# EAGLE design 7segement4digits1badidea-mk-3-smd (EAGLE 6.5.0)
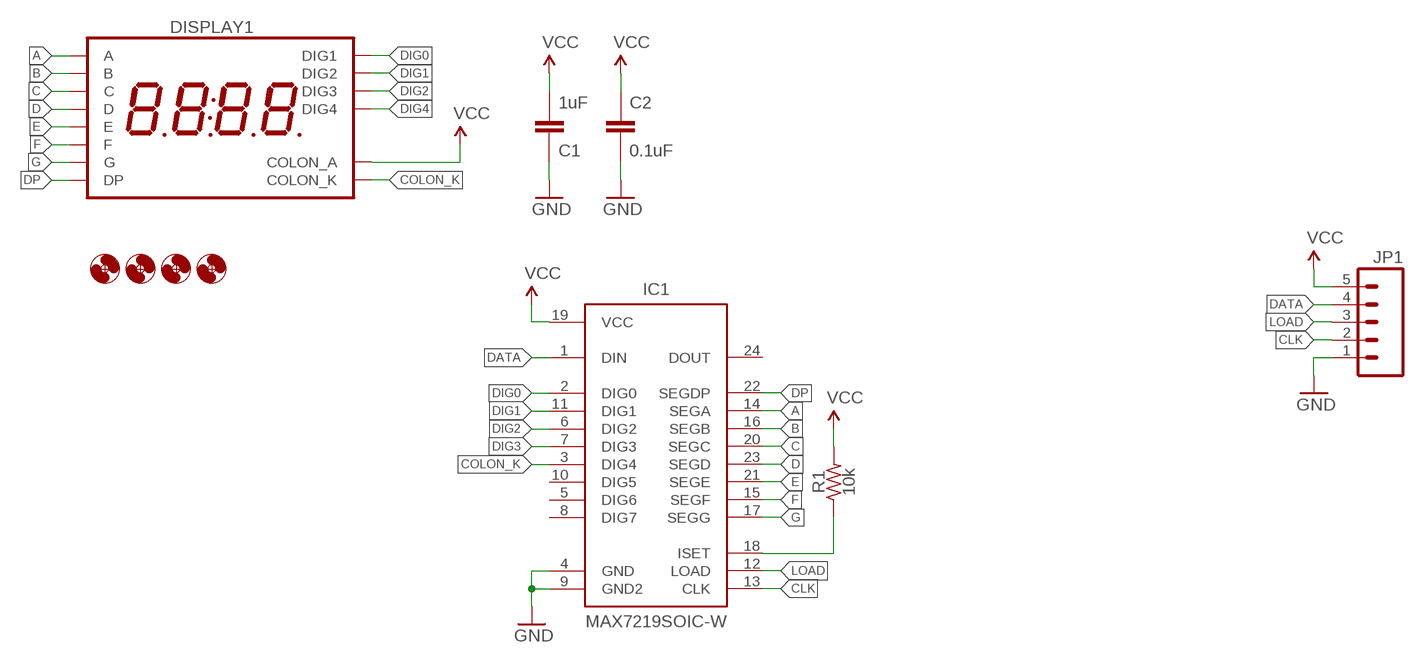
[diagram p0: schematic, sheet 1]

## Parts
C1  1uF  CAPACITOR-CERAMICC0805  [C0805]
C2  0.1uF  CAPACITOR-CERAMICC0603  [C0603]
DISPLAY1  7SEG_4DIGIT_COLONLOLSMDWAT  [7SEG_4DIG_0.56IN_14MM_ADAFRUIT_LOL_SMD_WAT]
H1  HOLE#2  [HOLE-#2]
H2  HOLE#2  [HOLE-#2]
H3  HOLE#2  [HOLE-#2]
H4  HOLE#2  [HOLE-#2]
IC1  MAX7219SOIC-W  [SO24W]
JP1  M05JST-PH-VERT-PTH  [JST-5-PH-VERT-PTH]
R1  10k  RESISTORR0603  [R0603]

## Nets
A: DISPLAY1.P$13(A) IC1.14(SEGA)
B: DISPLAY1.P$9(B) IC1.16(SEGB)
C: DISPLAY1.P$4(C) IC1.20(SEGC)
CLK: IC1.13(CLK) JP1.2
COLON_K: DISPLAY1.P$7(COLON_K) IC1.3(DIG4)
D: DISPLAY1.P$2(D) IC1.23(SEGD)
DATA: IC1.1(DIN) JP1.4
DIG0: DISPLAY1.P$14(DIG1) IC1.2(DIG0)
DIG1: DISPLAY1.P$11(DIG2) IC1.11(DIG1)
DIG2: DISPLAY1.P$10(DIG3) IC1.6(DIG2)
DIG3: IC1.7(DIG3)
DIG4: DISPLAY1.P$6(DIG4)
DP: DISPLAY1.P$3(DP) IC1.22(SEGDP)
E: DISPLAY1.P$1(E) IC1.21(SEGE)
F: DISPLAY1.P$12(F) IC1.15(SEGF)
G: DISPLAY1.P$5(G) IC1.17(SEGG)
GND: C1.1 C2.2 IC1.4(GND) IC1.9(GND2) JP1.1
LOAD: IC1.12(LOAD) JP1.3
N$1: IC1.18(ISET) R1.1
VCC: C1.2 C2.1 DISPLAY1.P$8(COLON_A) IC1.19(VCC) JP1.5 R1.2
Unconnected: IC1.5(DIG6) IC1.8(DIG7) IC1.10(DIG5) IC1.24(DOUT)

## Library data of the parts
C1 C2 = A_butts:CAPACITOR-CERAMIC: CAPACITOR, European symbol
DISPLAY1 = A_butts:7SEG_4DIGIT_COLON
H1-H4 = A_butts:HOLE: MOUNTING HOLE with drill center marker
IC1 = A_butts:MAX7219: 8-digit, 8-segment LED display driver, serial input
JP1 = A_butts:M05: Header 5 Standard 5-pin 0.1" header. Use with straight break away headers (SKU : PRT-00116), right angle break away headers (PRT-00553), swiss pins (PRT-00743), machine pins (PRT-00117), and female headers (PRT-00115). Molex polarized connector foot print use with SKU : PRT-08230 with associated crimp pins and housings.
R1 = A_butts:RESISTOR: RESISTOR, American symbol

## Board
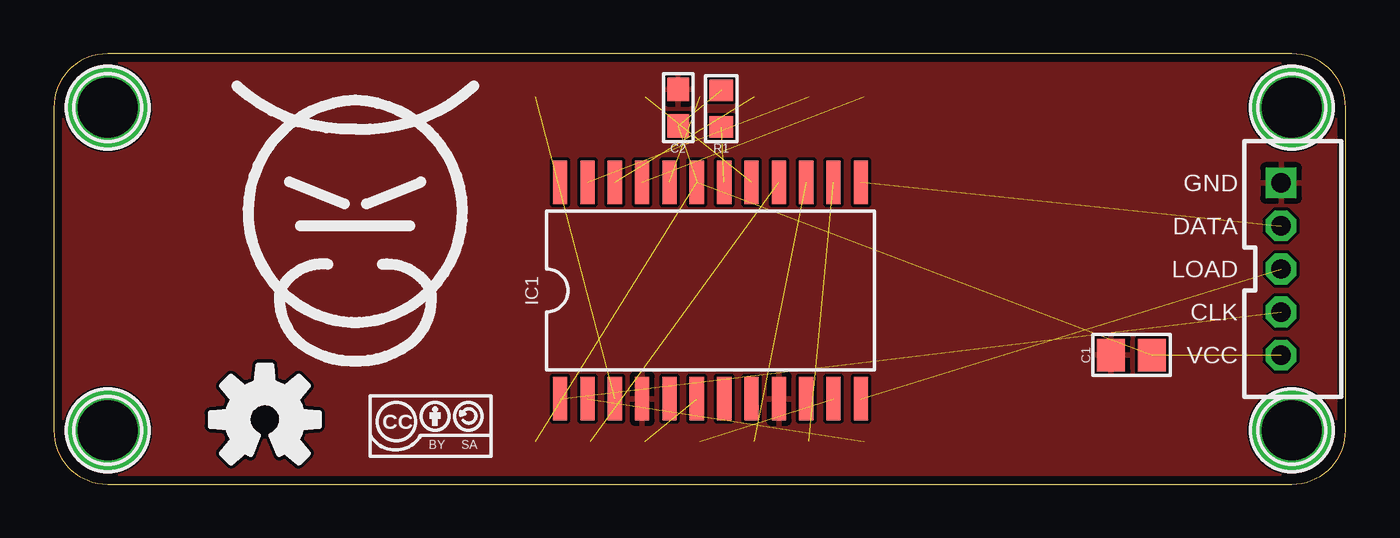
[diagram p1: board, top side]
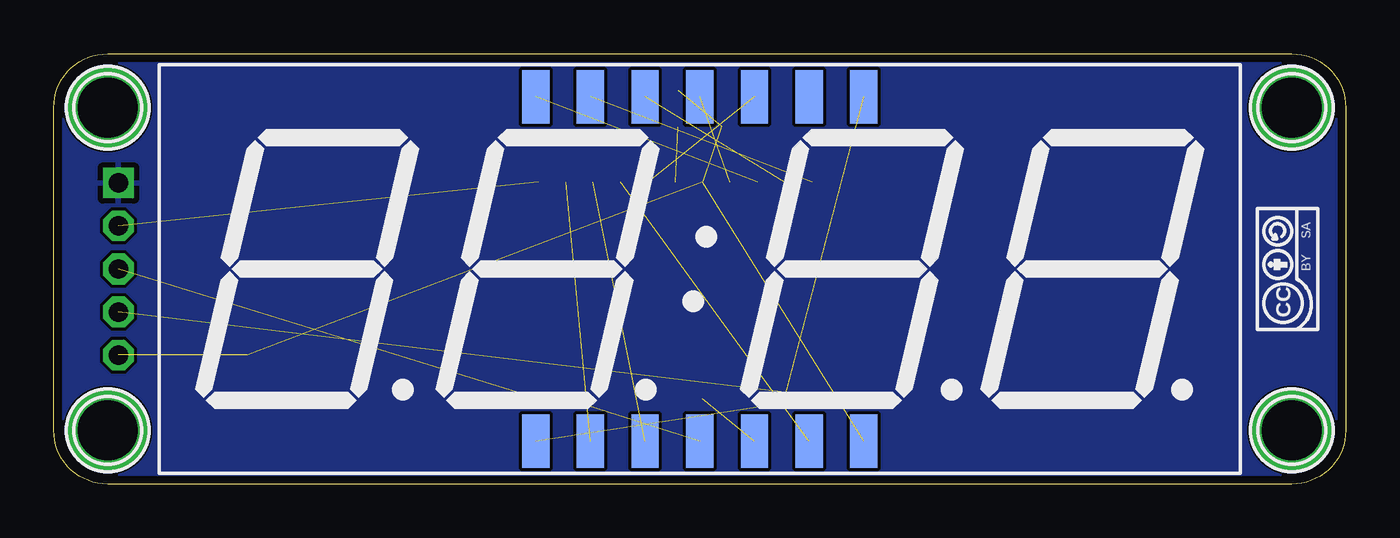
[diagram p2: board, bottom side, seen from below]

Size 60 x 20 mm. Coordinates in mm from the lower left corner, seen from the top.
Outline: 0,17.5 0,2.5 arc90 2.5,0 57.5,0 arc90 60,2.5 60,17.5 arc90 57.5,20 2.5,20 arc90 0,17.5
Copper layers (1*16): Top 0.0356mm / dielectric 1.5011mm / Bottom 0.0356mm
Design rules "LaenPCBOrder2": minimum track width 6mil, minimum drill 13mil, track to track 6mil, track to pad 6mil, pad to pad 6mil, via to via 6mil, smd to smd 6mil, copper to edge 15mil, drill to drill 6mil, minimum pad ring 7mil, minimum via ring 7mil, stop-mask expansion 3mil, vias tented up to drill 20mil, thermal gap 10mil

### Footprints (pad centres in the part's own frame; a part is rotated, then mirrored left to right if it is on the bottom)
C0805 = smd 1.3 x 1.5: 1 -0.95,0; 2 0.95,0
C0603 = smd 1.1 x 1: 1 -0.85,0; 2 0.85,0
7SEG_4DIG_0.56IN_14MM_ADAFRUIT_LOL_SMD_WAT = smd 1.27 x 2.5: P$1 -7.62,8; P$2 -5.08,8; P$3 -2.54,8; P$4 0,8; P$5 2.54,8; P$6 5.08,8; P$7 7.62,8; P$8 7.62,-8; P$9 5.08,-8; P$10 2.54,-8; P$11 0,-8; P$12 -2.54,-8; P$13 -5.08,-8; P$14 -7.62,-8
HOLE-#2 = drill 2.8 pad 3.81: P$1 0,0
SO24W = smd 0.66 x 2.032: 1 -6.985,-5.029; 2 -5.715,-5.029; 3 -4.445,-5.029; 4 -3.175,-5.029; 5 -1.905,-5.029; 6 -0.635,-5.029; 7 0.635,-5.029; 8 1.905,-5.029; 9 3.175,-5.029; 10 4.445,-5.029; 11 5.715,-5.029; 12 6.985,-5.029; 13 6.985,5.029; 14 5.715,5.029; 15 4.445,5.029; 16 3.175,5.029; 17 1.905,5.029; 18 0.635,5.029; 19 -0.635,5.029; 20 -1.905,5.029; 21 -3.175,5.029; 22 -4.445,5.029; 23 -5.715,5.029; 24 -6.985,5.029
JST-5-PH-VERT-PTH = drill 0.9 pad 1.422 square: 1 -4,0 | drill 0.9 pad 1.422 octagon: 2 -2,0; 3 0,0; 4 2,0; 5 4,0
R0603 = smd 1 x 1.1: 1 -0.85,0; 2 0.85,0

### Placement (x,y rotation side)
C1  50.05,6 0 top
C2  29,17.5 90 top
DISPLAY1  30,10 0 bottom
H1  2.5,2.5 0 top
H2  2.5,17.5 0 top
H3  57.5,2.5 0 top
H4  57.5,17.5 0 top
IC1  30.5,9 0 top
JP1  57,10 270 top
R1  31,17.45 90 top
U$1  [COW]  14,11.5 0 top
U$2  [CC-BY-SA-4.0-NO-URL]  17.5,2.7 0 top
U$3  [OSHWLOGO_TOP_0.2_A]  9.8,3 0 top
U$5  [CC-BY-SA-4.0-NO-URL]  2.7,10 90 bottom

### Tracks (layer width: path | path; a pad name or v marks a point on that pad's centre or on a via)
A  (1 unrouted)
B  (1 unrouted)
C  (1 unrouted)
CLK  (1 unrouted)
COLON_K  (1 unrouted)
D  (1 unrouted)
DATA  (1 unrouted)
DIG0  (1 unrouted)
DIG1  (1 unrouted)
DIG2  (1 unrouted)
DP  (1 unrouted)
E  (1 unrouted)
F  (1 unrouted)
G  (1 unrouted)
GND
  pour Top: 2.5,20 57.5,20 arc-90 60,17.5 60,2.5 arc-90 57.5,0 2.5,0 arc-90 0,2.5 0,17.5 arc-90
  pour Bottom: 2.5,20 57.5,20 arc-90 60,17.5 60,2.5 arc-90 57.5,0 2.5,0 arc-90 0,2.5 0,17.5 arc-90
LOAD  (1 unrouted)
N$1  (1 unrouted)
VCC  (5 unrouted)

### Text on the board
tPlace: GND | DATA | LOAD | CLK | VCC